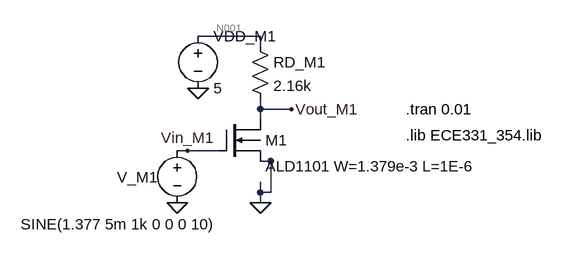
[diagram p0: schematic ac_small_sig_M1.asc]
ac_small_sig_M1.asc, the LTspice schematic file:
Version 4
SHEET 1 880 680
WIRE -496 -32 -592 -32
WIRE -496 -16 -496 -32
WIRE -496 80 -496 64
WIRE -448 80 -496 80
WIRE -496 96 -496 80
WIRE -608 144 -624 144
WIRE -560 144 -608 144
WIRE -480 160 -496 160
WIRE -496 208 -496 192
WIRE -480 208 -480 160
WIRE -480 208 -496 208
WIRE -496 224 -496 208
FLAG -592 48 0
FLAG -496 224 0
FLAG -624 224 0
FLAG -448 80 Vout_M1
FLAG -608 144 Vin_M1
SYMBOL ECE331\\ALD1101 -560 96 R0
SYMATTR InstName M1
SYMBOL voltage -592 -48 R0
WINDOW 123 0 0 Left 0
WINDOW 39 0 0 Left 0
SYMATTR InstName VDD_M1
SYMATTR Value 5
SYMBOL res -512 -32 R0
SYMATTR InstName RD_M1
SYMATTR Value 2.16k
SYMBOL voltage -624 128 R0
WINDOW 123 0 0 Left 0
WINDOW 39 0 0 Left 0
WINDOW 0 -93 57 Left 2
WINDOW 3 -241 129 Left 2
SYMATTR InstName V_M1
SYMATTR Value SINE(1.377 5m 1k 0 0 0 10)
TEXT -272 80 Left 2 !.tran 0.01
TEXT -272 120 Left 2 !.lib ECE331_354.lib

The netlist it stands for:
* ac_small_sig_M1.asc
M1 Vout_M1 Vin_M1 0 0 ALD1101 W=1.379e-3 L=1E-6
VDD_M1 N001 0 5
RD_M1 N001 Vout_M1 2.16k
V_M1 Vin_M1 0 SINE(1.377 5m 1k 0 0 0 10)
.model NMOS NMOS
.model PMOS PMOS
.lib standard.mos
.tran 0.01
.lib ECE331_354.lib
.backanno
.end

* Results of the author's LTspice run, read from the files saved beside the schematic
* Operating Point, zero values left out:
*   V(vout_m1) = 2.732 V
*   V(vin_m1) = 1.377 V
*   V(n001) = 5 V
*   Id(M1) = 1.05 mA
*   Ib(M1) = -2.749 pA
*   Is(M1) = -1.05 mA
*   I(Rd_m1) = 1.05 mA
*   I(Vdd_m1) = -1.05 mA
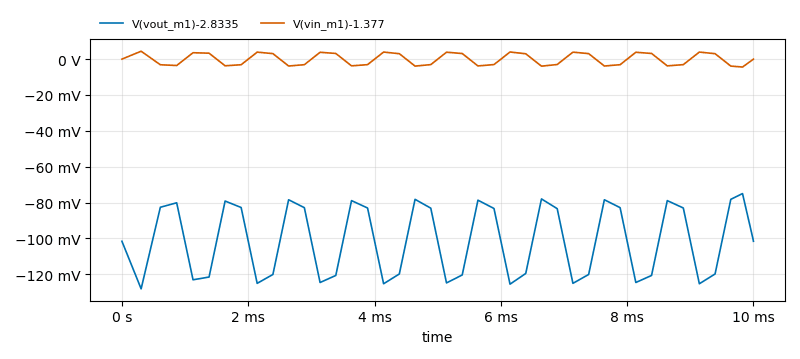
[diagram p1: Transient Analysis of ac_small_sig_M1.asc, plotted from the saved traces]
* Transient Analysis, 1 run:
*   V(vout_m1)-2.8335: min -128.1 mV, max -74.97 mV, average -101.4 mV, rms 103.6 mV, last -101.6 mV
*   V(vin_m1)-1.377: min -4.422 mV, max 4.394 mV, average -32.75 µV, rms 3.494 mV, last -25.75 nV